# Altium project 电磁阀V4.0_Project.PrjPcb
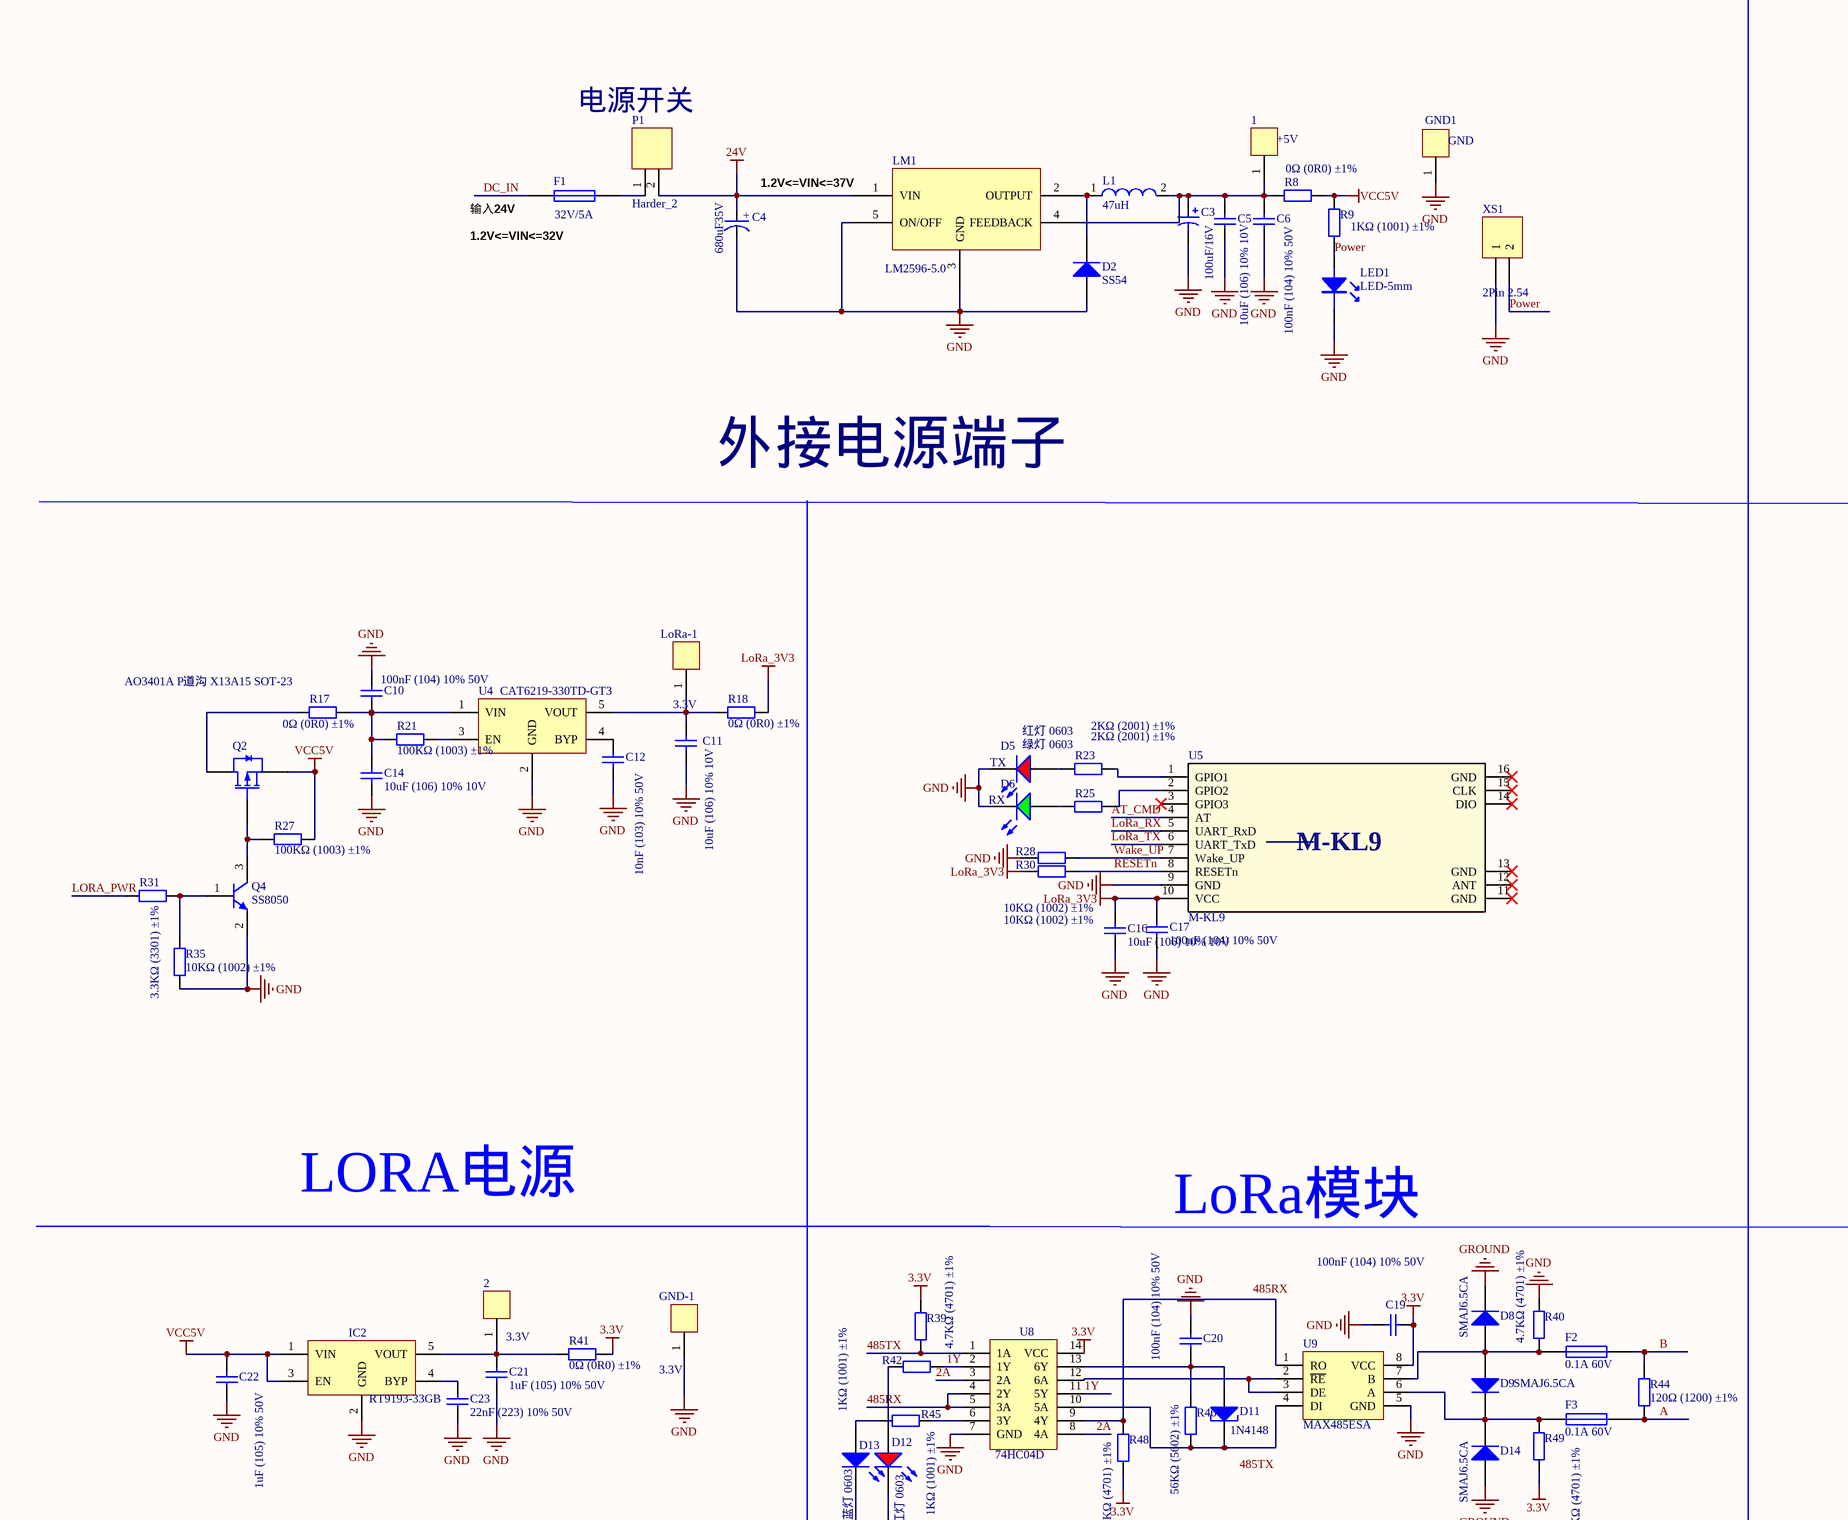
[diagram p0: 电磁阀V4.0.SchDoc, top left]
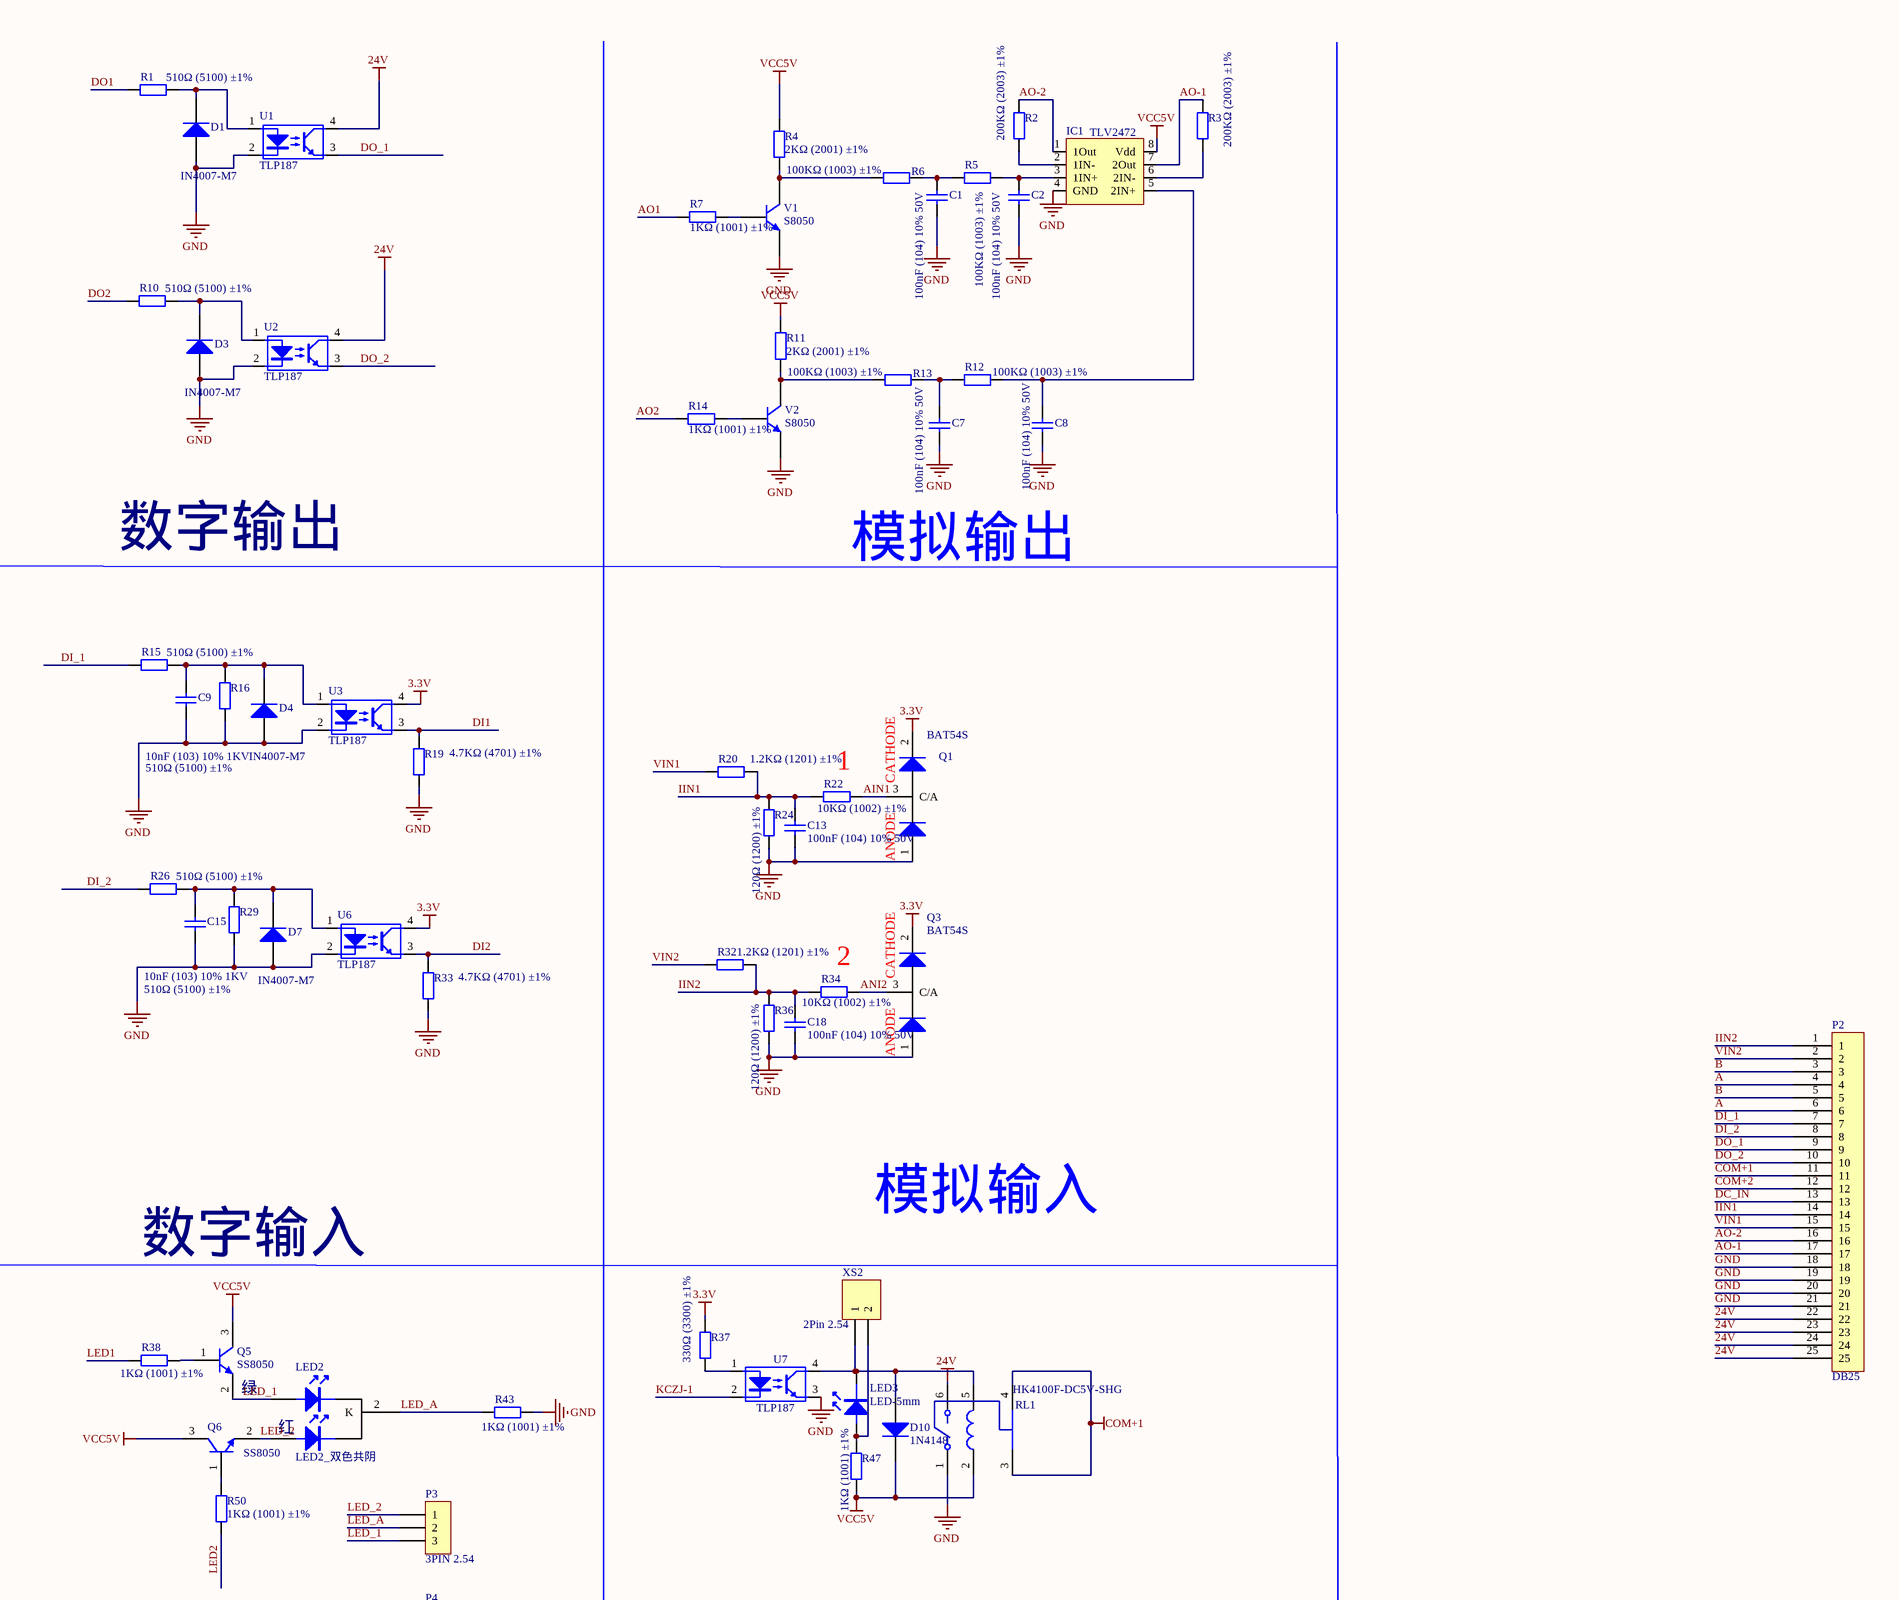
[diagram p1: 电磁阀V4.0.SchDoc, top right]
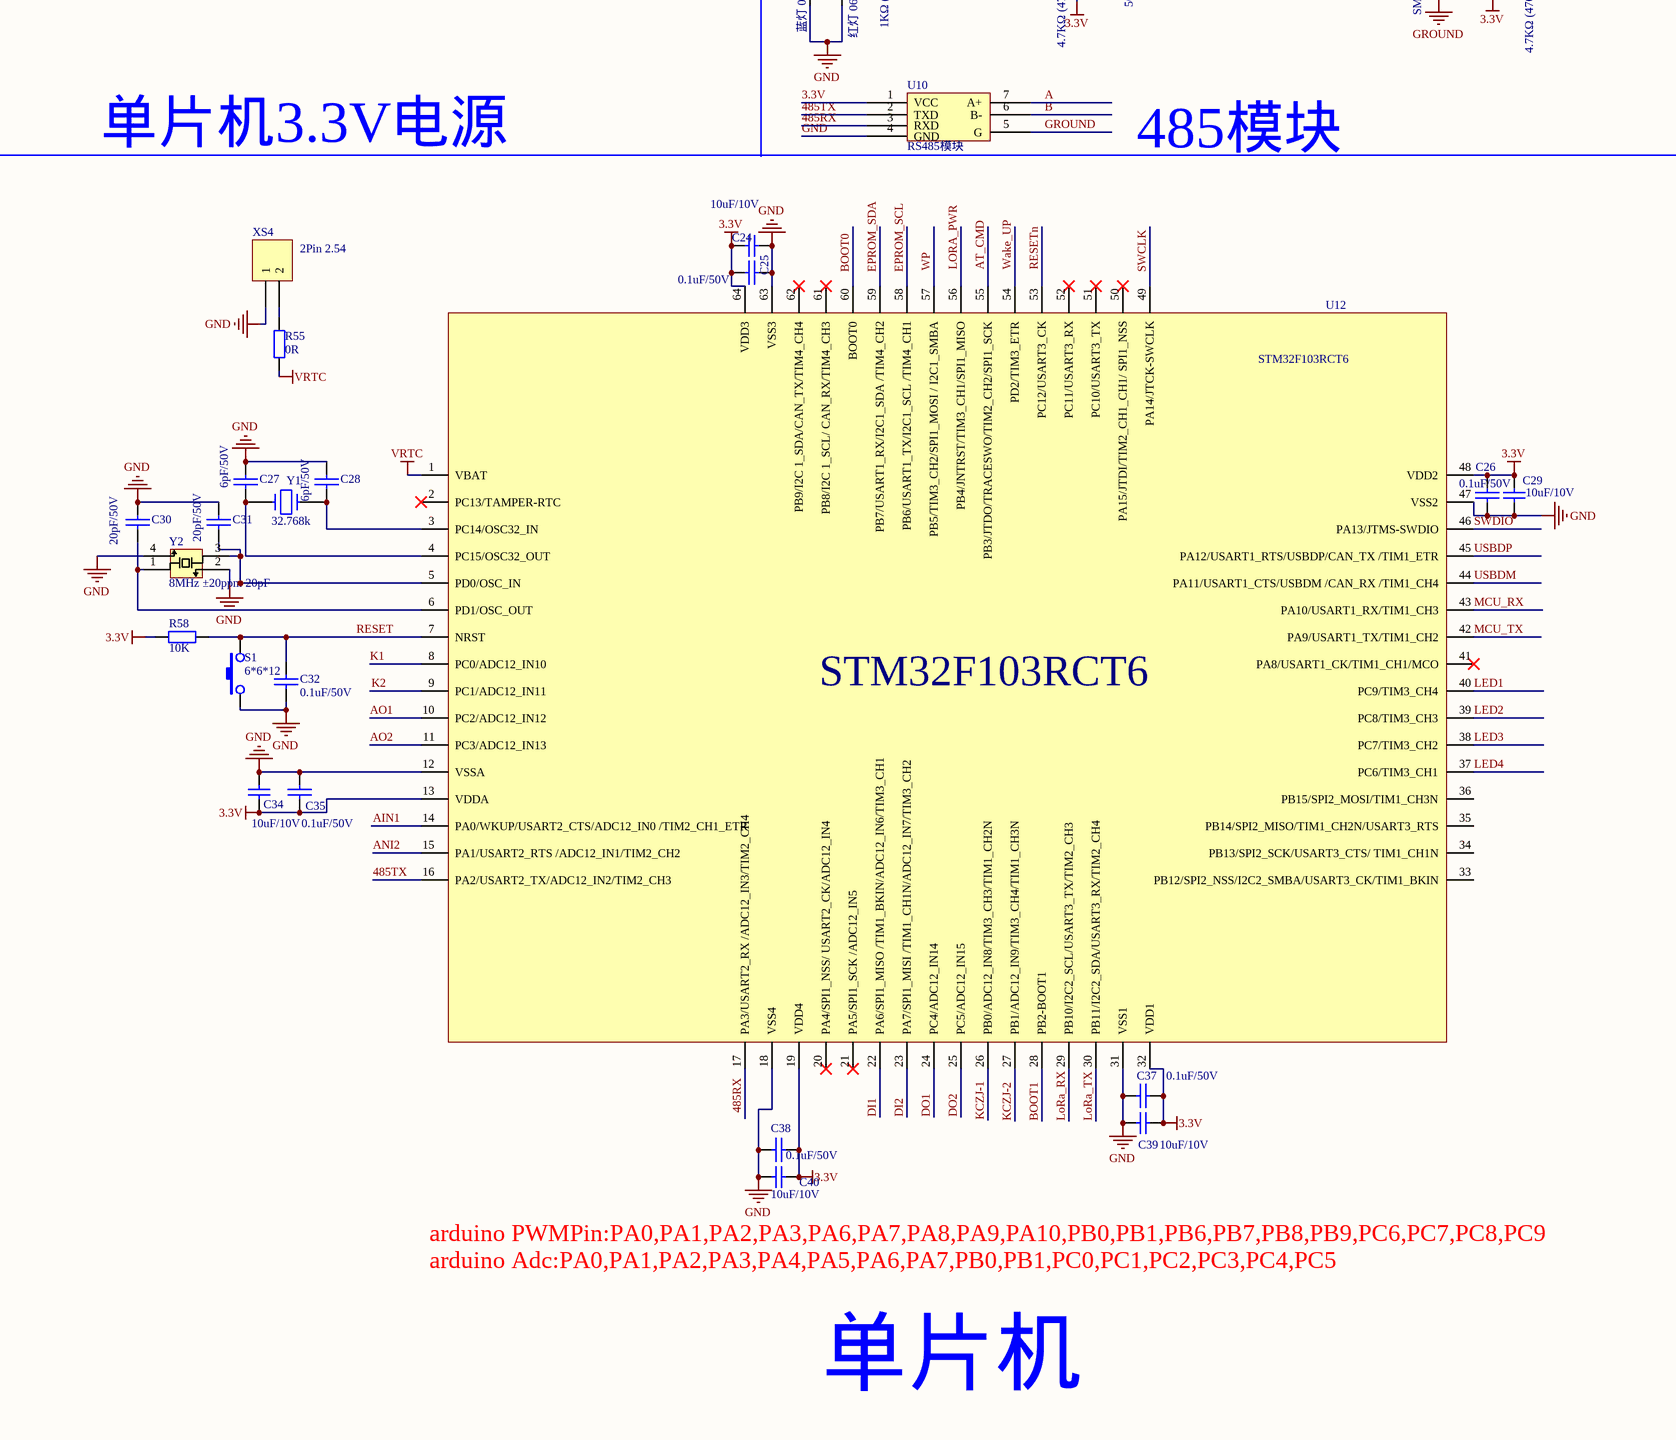
[diagram p2: 电磁阀V4.0.SchDoc, bottom left]
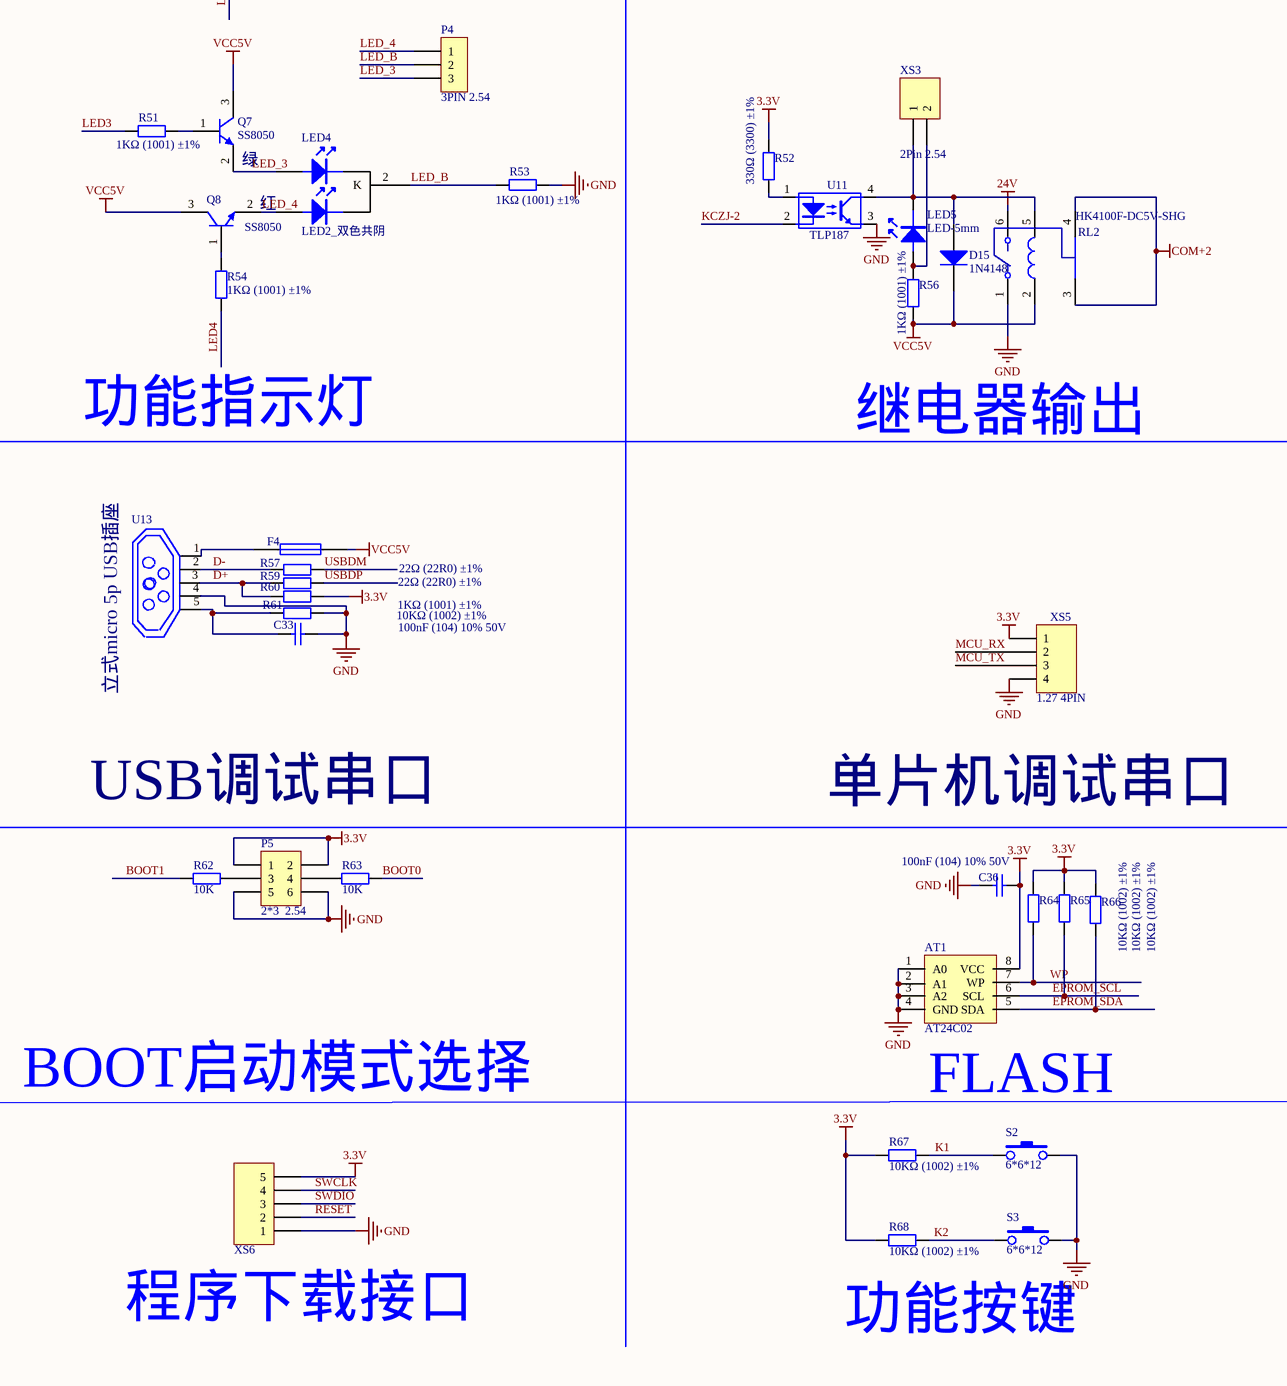
[diagram p3: 电磁阀V4.0.SchDoc, bottom right]
1 sheet, 183 parts. Net scope: global (net labels, ports and power ports of the same name join across sheets).
Board file: 电磁阀V4.0.PcbDoc

## Sheet 电磁阀V4.0.SchDoc
size A1

### Parts
1  +5V  [TEST_POINT]
2  3.3V  [TEST_POINT]
AT1  AT24C02  [AT24C02]
C1  100nF (104) 10% 50V  [LC-0603_C]
C2  100nF (104) 10% 50V  [LC-0603_C]
C3  100uF/16V  [CAP5*X]
C4  680uF35V  [C10x16]
C5  10uF (106) 10% 10V  [LC-0603_C]
C6  100nF (104) 10% 50V  [LC-0603_C]
C7  100nF (104) 10% 50V  [LC-0603_C]
C8  100nF (104) 10% 50V  [LC-0603_C]
C9  10nF (103) 10% 1KV  [LC-1206_C]
C10  100nF (104) 10% 50V  [LC-0603_C]
C11  10uF (106) 10% 10V  [LC-0603_C]
C12  10nF (103) 10% 50V  [LC-0603_C]
C13  100nF (104) 10% 50V  [LC-0603_C]
C14  10uF (106) 10% 10V  [LC-0603_C]
C15  10nF (103) 10% 1KV  [LC-1206_C]
C16  10uF (106) 10% 10V  [LC-0603_C]
C17  100nF (104) 10% 50V  [LC-0603_C]
C18  100nF (104) 10% 50V  [LC-0603_C]
C19  100nF (104) 10% 50V  [LC-0603_C]
C20  100nF (104) 10% 50V  [LC-0603_C]
C21  1uF (105) 10% 50V  [LC-0603_C]
C22  1uF (105) 10% 50V  [LC-0603_C]
C23  22nF (223) 10% 50V  [LC-0603_C]
C24  10uF/10V  [C-0603]
C25  0.1uF/50V  [C-0603]
C26  0.1uF/50V  [C-0603]
C27  6pF/50V  [C-0603]
C28  6pF/50V  [C-0603]
C29  10uF/10V  [C-0603]
C30  20pF/50V  [C-0603]
C31  20pF/50V  [C-0603]
C32  0.1uF/50V  [C-0603]
C33  100nF (104) 10% 50V  [LC-0603_C]
C34  10uF/10V  [C-0603]
C35  0.1uF/50V  [C-0603]
C36  100nF (104) 10% 50V  [LC-0603_C]
C37  0.1uF/50V  [C-0603]
C38  0.1uF/50V  [C-0603]
C39  10uF/10V  [C-0603]
C40  10uF/10V  [C-0603]
D1  IN4007-M7  [DO-214AC]
D2  SS54  [LC-SMA(DO-214AC)_S1]
D3  IN4007-M7  [DO-214AC]
D4  IN4007-M7  [DO-214AC]
D5  红灯 0603  [LC-0603_LED_S1]
D6  绿灯 0603  [LC-0603_LED_S1]
D7  IN4007-M7  [DO-214AC]
D8  SMAJ6.5CA  [DO-214AC]
D9  SMAJ6.5CA  [DO-214AC]
D10  1N4148  [SOD-123]
D11  1N4148  [LL-34]
D12  红灯 0603  [LC-0603_LED_S1]
D13  蓝灯 0603  [LC-0603_LED_S1]
D14  SMAJ6.5CA  [DO-214AC]
D15  1N4148  [SOD-123]
F1  32V/5A  [Fuse-1206]
F2  0.1A 60V  [R-1812]
F3  0.1A 60V  [R-1812]
F4  32V/5A  [FUSE-1206]  (value not drawn)
GND1  GND  [TEST_POINT]
GND-1  3.3V  [TEST_POINT]
IC1  TLV2472  [SOP8]
IC2  RT9193-33GB  [SOT23-5]
L1  value 47uH  [SMD,13.8x12.6x7mm]  (hidden comment: 47uH ±20%)
LED1  LED-5mm  [LED_5mm]
LED2  LED2_双色共阴  [双色LED]
LED3  LED-5mm  [LED_5mm]
LED4  LED2_双色共阴  [双色LED]
LED5  LED-5mm  [LED_5mm]
LM1  LM2596-5.0  [LC-TO-263-5]
LoRa-1  3.3V  [TEST_POINT]
P1  Harder_2  [2Pin-2.54A]
P2  DB25  [DB25]
P3  3PIN 2.54  [JXT-3-l]
P4  3PIN 2.54  [JXT-3-l]
P5  2*3  2.54  [201S2X3]
Q1  BAT54S  [SOT-23-3]
Q2  AO3401A P道沟 X13A15 SOT-23  [LC-SOT-23-3L]
Q3  BAT54S  [SOT-23-3]
Q4  SS8050  [SOT-23]
Q5  SS8050  [SOT-23]
Q6  SS8050  [SOT-23]
Q7  SS8050  [SOT-23]
Q8  SS8050  [SOT-23]
R1  510Ω (5100) ±1%  [LC-0603_R]
R2  200KΩ (2003) ±1%  [LC-0603_R]
R3  200KΩ (2003) ±1%  [LC-0603_R]
R4  2KΩ (2001) ±1%  [LC-0603_R]
R5  100KΩ (1003) ±1%  [LC-0603_R]
R6  100KΩ (1003) ±1%  [LC-0603_R]
R7  1KΩ (1001) ±1%  [LC-0603_R]
R8  0Ω (0R0) ±1%  [LC-0603_R]
R9  1KΩ (1001) ±1%  [LC-0603_R]
R10  510Ω (5100) ±1%  [LC-0603_R]
R11  2KΩ (2001) ±1%  [LC-0603_R]
R12  100KΩ (1003) ±1%  [LC-0603_R]
R13  100KΩ (1003) ±1%  [LC-0603_R]
R14  1KΩ (1001) ±1%  [LC-0603_R]
R15  510Ω (5100) ±1%  [LC-0603_R]
R16  510Ω (5100) ±1%  [LC-0603_R]
R17  0Ω (0R0) ±1%  [LC-0603_R]
R18  0Ω (0R0) ±1%  [LC-0603_R]
R19  4.7KΩ (4701) ±1%  [LC-0603_R]
R20  1.2KΩ (1201) ±1%  [LC-0603_R]
R21  100KΩ (1003) ±1%  [LC-0603_R]
R22  10KΩ (1002) ±1%  [LC-0603_R]
R23  2KΩ (2001) ±1%  [LC-0603_R]
R24  120Ω (1200) ±1%  [LC-0603_R]
R25  2KΩ (2001) ±1%  [LC-0603_R]
R26  510Ω (5100) ±1%  [LC-0603_R]
R27  100KΩ (1003) ±1%  [LC-0603_R]
R28  10KΩ (1002) ±1%  [LC-0603_R]
R29  510Ω (5100) ±1%  [LC-0603_R]
R30  10KΩ (1002) ±1%  [LC-0603_R]
R31  3.3KΩ (3301) ±1%  [LC-0603_R]
R32  1.2KΩ (1201) ±1%  [LC-0603_R]
R33  4.7KΩ (4701) ±1%  [LC-0603_R]
R34  10KΩ (1002) ±1%  [LC-0603_R]
R35  10KΩ (1002) ±1%  [LC-0603_R]
R36  120Ω (1200) ±1%  [LC-0603_R]
R37  330Ω (3300) ±1%  [LC-0603_R]
R38  1KΩ (1001) ±1%  [LC-0603_R]
R39  4.7KΩ (4701) ±1%  [LC-0603_R]
R40  4.7KΩ (4701) ±1%  [LC-0603_R]
R41  0Ω (0R0) ±1%  [LC-0603_R]
R42  1KΩ (1001) ±1%  [LC-0603_R]
R43  1KΩ (1001) ±1%  [LC-0603_R]
R44  120Ω (1200) ±1%  [LC-0603_R]
R45  1KΩ (1001) ±1%  [LC-0603_R]
R46  56KΩ (5602) ±1%  [LC-0603_R]
R47  1KΩ (1001) ±1%  [LC-0603_R]
R48  4.7KΩ (4701) ±1%  [LC-0603_R]
R49  4.7KΩ (4701) ±1%  [LC-0603_R]
R50  1KΩ (1001) ±1%  [LC-0603_R]
R51  1KΩ (1001) ±1%  [LC-0603_R]
R52  330Ω (3300) ±1%  [LC-0603_R]
R53  1KΩ (1001) ±1%  [LC-0603_R]
R54  1KΩ (1001) ±1%  [LC-0603_R]
R55  0R  [R-0603]
R56  1KΩ (1001) ±1%  [LC-0603_R]
R57  22Ω (22R0) ±1%  [LC-0603_R]
R58  10K  [R-0603]
R59  22Ω (22R0) ±1%  [LC-0603_R]
R60  1KΩ (1001) ±1%  [LC-0603_R]
R61  10KΩ (1002) ±1%  [LC-0603_R]
R62  10K  [R-0603]
R63  10K  [R-0603]
R64  10KΩ (1002) ±1%  [LC-0603_R]
R65  10KΩ (1002) ±1%  [LC-0603_R]
R66  10KΩ (1002) ±1%  [LC-0603_R]
R67  10KΩ (1002) ±1%  [LC-0603_R]
R68  10KΩ (1002) ±1%  [LC-0603_R]
RL1  HK4100F-DC5V-SHG  [HK4100F-DC5V-SHG]
RL2  HK4100F-DC5V-SHG  [HK4100F-DC5V-SHG]
S1  6*6*12  [KEY-7.0*7.0]
S2  6*6*12  [KEY-7.0*7.0]
S3  6*6*12  [KEY-7.0*7.0]
U1  TLP187  [LC-SOP-4_P2.54]
U2  TLP187  [LC-SOP-4_P2.54]
U3  TLP187  [LC-SOP-4_P2.54]
U4  CAT6219-330TD-GT3  [SOT23-5]
U5  M-KL9  [M-KL9]
U6  TLP187  [LC-SOP-4_P2.54]
U7  TLP187  [TLP187 - duplicate]
U8  74HC04D  [SOIC-14_150mil]
U9  MAX485ESA  [SOP-8_150mil]
U10  RS485模块  [RS485MOD]
U11  TLP187  [TLP187 - duplicate]
U12  STM32F103RCT6  [LQFP-64_10x10x05P]
U13  立式micro 5p USB插座  [USB插座 micro 5p]
V1  S8050  [SOT-23-3]
V2  S8050  [SOT-23-3]
XS1  2Pin 2.54  [JXT-2]
XS2  2Pin 2.54  [JXT-2]
XS3  2Pin 2.54  [JXT-2]
XS4  2Pin 2.54  [JXT-2]
XS5  1.27 4PIN  [JXT-4]
XS6  Header 2.54X4  [JXT-5]  (value not drawn)
Y1  32.768k  [3215_32.768K]
Y2  8MHz ±20ppm 20pF  [LC-SMD-5032_4P]

### Nets
3.3V: AT1.8(VCC) C19.1 C24.1 C25.1 C26.1 C29.2 C34.2 C35.2 C36.2 C37.2 C38.2 C39.1 C40.1 P5.1 P5.2 Q1.2(CATHODE) Q3.2(CATHODE) R37.2 R39.2 R41.2 R48.1 R49.1 R52.2 R58.2 R60.2 R64.2 R65.2 R66.2 R67.1 R68.1 U3.4(Collector) U6.4(Collector) U8.14(VCC) U9.8(VCC) U10.1(VCC) U12.13(VDDA) U12.19(VDD4) U12.32(VDD1) U12.48(VDD2) U12.64(VDD3) XS5.1 XS6.5
24V: C4.1 LM1.1(VIN) P1.2 P2.22 P2.23 P2.24 P2.25 RL1.6 RL2.6 U1.4(Collector) U2.4(Collector)
COM+1: P2.11 RL1.3 RL1.4
COM+2: P2.12 RL2.3 RL2.4
GND: AT1.1(A0) AT1.2(A1) AT1.3(A2) AT1.4(GND) C1.1 C2.1 C3.2 C4.2 C5.1 C6.1 C7.1 C8.1 C9.1 C10.2 C11.1 C12.1 C13.1 C14.1 C15.1 C16.1 C17.1 C18.1 C19.2 C20.2 C21.1 C22.1 C23.1 C24.2 C25.2 C26.2 C27.2 C28.2 C29.1 C30.2 C31.2 C32.2 C33.1 C34.1 C35.1 C36.1 C37.1 C38.1 C39.2 C40.2 D1.1(A) D2.1(A) D3.1(A) D4.1(A) D5.K D6.K D7.1(A) D12.K D13.K GND1.1 GND-1.1 IC1.4(GND) IC2.2(GND) LED1.2 LM1.3(GND) LM1.5(ON/OFF) P2.18 P2.19 P2.20 P2.21 P5.5 P5.6 Q1.1(ANODE) Q3.1(ANODE) Q4.2(E) R16.1 R19.1 R24.1 R28.1 R29.1 R33.1 R35.1 R36.1 R40.1 R43.1 R53.1 R61.1 RL1.1 RL2.1 S1.1 S2.2 S3.2 U1.2(LED_Cathode) U2.2(LED_Cathode) U3.2(LED_Cathode) U4.2(GND) U5.9(GND) U6.2(LED_Cathode) U7.3(Emitter) U8.7(GND) U9.5(GND) U10.4(GND) U11.3(Emitter) U12.12(VSSA) U12.18(VSS4) U12.31(VSS1) U12.47(VSS2) U12.63(VSS3) U13.4 V1.2(E) V2.2(E) XS1.1 XS4.1 XS5.4 XS6.1 Y2.2(G) Y2.4(G)
GROUND: D8.2(K) D14.1(A) U10.5(G)
LoRa_3V3: C16.2 C17.2 R18.2 R30.1 U5.10(VCC)
VCC5V: C22.2 D10.2(K) D15.2(K) F4.2 IC1.8(Vdd) IC2.1(VIN) IC2.3(EN) Q2.2(S) Q5.3(C) Q6.3(C) Q7.3(C) Q8.3(C) R4.2 R8.2 R9.1 R11.2 R27.2 R47.1 R56.1 RL1.2 RL2.2
VRTC: R55.2 U12.1(VBAT)
1Y: R42.2 U8.2(1Y) U8.11(5Y)
2A: U8.3(2A) U8.8(4A)
485RX: U8.4(2Y) U8.5(3A) U10.3(RXD) U12.17(PA3/USART2_RX_/ADC12_IN3/TIM2_CH4)
485TX: R39.1 U8.1(1A) U10.2(TXD) U12.16(PA2/USART2_TX/ADC12_IN2/TIM2_CH3)
A: F3.2 P2.4 P2.6 R44.1 U10.7(A+)
AIN1: Q1.3(C/A) R22.2 U12.14(PA0/WKUP/USART2_CTS/ADC12_IN0_/TIM2_CH1_ETR)
ANI2: Q3.3(C/A) R34.2 U12.15(PA1/USART2_RTS_/ADC12_IN1/TIM2_CH2)
AO1: R7.1 U12.10(PC2/ADC12_IN12)
AO2: R14.1 U12.11(PC3/ADC12_IN13)
AO-1: IC1.7(2Out) P2.17 R3.2
AO-2: IC1.1(1Out) P2.16 R2.2
AT_CMD: U5.4(AT) U12.55(PB3/JTDO/TRACESWO/TIM2_CH2/SPI1_SCK)
B: F2.2 P2.3 P2.5 R44.2 U10.6(B-)
BOOT0: R63.2 U12.60(BOOT0)
BOOT1: R62.1 U12.28(PB2-BOOT1)
D+: R59.1 R60.1 U13.3
D-: R57.1 U13.2
DC_IN: F1.1 P2.13
DI1: R19.2 U3.3(Emitter) U12.22(PA6/SPI1_MISO_/TIM1_BKIN/ADC12_IN6/TIM3_CH1)
DI2: R33.2 U6.3(Emitter) U12.23(PA7/SPI1_MISI_/TIM1_CH1N/ADC12_IN7/TIM3_CH2)
DI_1: P2.7 R15.1
DI_2: P2.8 R26.1
DO1: R1.1 U12.24(PC4/ADC12_IN14)
DO2: R10.1 U12.25(PC5/ADC12_IN15)
DO_1: P2.9 U1.3(Emitter)
DO_2: P2.10 U2.3(Emitter)
EPROM_SCL: AT1.6(SCL) R65.1 U12.58(PB6/USART1_TX/I2C1_SCL_/TIM4_CH1)
EPROM_SDA: AT1.5(SDA) R66.1 U12.59(PB7/USART1_RX/I2C1_SDA_/TIM4_CH2)
IIN1: C13.2 P2.14 R20.2 R22.1 R24.2
IIN2: C18.2 P2.1 R32.2 R34.1 R36.2
K1: R67.2 S2.1 U12.8(PC0/ADC12_IN10)
K2: R68.2 S3.1 U12.9(PC1/ADC12_IN11)
KCZJ-1: U7.2(LED_Cathode) U12.26(PB0/ADC12_IN8/TIM3_CH3/TIM1_CH2N)
KCZJ-2: U11.2(LED_Cathode) U12.27(PB1/ADC12_IN9/TIM3_CH4/TIM1_CH3N)
LED1: R38.1 U12.40(PC9/TIM3_CH4)
LED2: R50.2 U12.39(PC8/TIM3_CH3)
LED3: R51.1 U12.38(PC7/TIM3_CH2)
LED4: R54.2 U12.37(PC6/TIM3_CH1)
LED_1: LED2.1(A) P3.3 Q5.2(E)
LED_2: LED2.3(A) P3.1 Q6.2(E)
LED_3: LED4.1(A) P4.3 Q7.2(E)
LED_4: LED4.3(A) P4.1 Q8.2(E)
LED_A: LED2.2(K) P3.2 R43.2
LED_B: LED4.2(K) P4.2 R53.2
LORA_PWR: R31.1 U12.56(PB4/JNTRST/TIM3_CH1/SPI1_MISO)
LoRa_RX: U5.5(UART_RxD) U12.29(PB10/I2C2_SCL/USART3_TX/TIM2_CH3)
LoRa_TX: U5.6(UART_TxD) U12.30(PB11/I2C2_SDA/USART3_RX/TIM2_CH4)
MCU_RX: U12.43(PA10/USART1_RX/TIM1_CH3) XS5.2
MCU_TX: U12.42(PA9/USART1_TX/TIM1_CH2) XS5.3
Power: LED1.1 R9.2 XS1.2
RESET: C32.1 R58.1 S1.2 U12.7(NRST) XS6.2
RESETn: R30.2 U5.8(RESETn) U12.53(PC12/USART3_CK)
SWCLK: U12.49(PA14/JTCK-SWCLK) XS6.4
SWDIO: U12.46(PA13/JTMS-SWDIO) XS6.3
USBDM: R57.2 U12.44(PA11/USART1_CTS/USBDM_/CAN_RX_/TIM1_CH4)
USBDP: R59.2 U12.45(PA12/USART1_RTS/USBDP/CAN_TX_/TIM1_ETR)
VIN1: P2.15 R20.1
VIN2: P2.2 R32.1
Wake_UP: R28.2 U5.7(Wake_UP) U12.54(PD2/TIM3_ETR)
WP: AT1.7(WP) R64.1 U12.57(PB5/TIM3_CH2/SPI1_MOSI_/_I2C1_SMBA)
Net1_1: 1.1 C3.1 C5.2 C6.2 L1.2 LM1.4(FEEDBACK) R8.1
Net2_1: 2.1 C21.2 IC2.5(VOUT) R41.1
NetC1_2: C1.2 R5.1 R6.2
NetC2_2: C2.2 IC1.3(1IN+) R5.2
NetC7_2: C7.2 R12.1 R13.2
NetC8_2: C8.2 IC1.5(2IN+) R12.2
NetC9_2: C9.2 D4.2(K) R15.2 R16.2 U3.1(LED_Anode)
NetC10_1: C10.1 C14.2 R17.2 R21.1 U4.1(VIN)
NetC11_2: C11.2 LoRa-1.1 R18.1 U4.5(VOUT)
NetC12_2: C12.2 U4.4(BYP)
NetC15_2: C15.2 D7.2(K) R26.2 R29.2 U6.1(LED_Anode)
NetC20_1: C20.1 D11.1 R46.2 U8.13(6Y)
NetC23_2: C23.2 IC2.4(BYP)
NetC27_1: C27.1 U12.4(PC15/OSC32_OUT) Y1.1
NetC28_1: C28.1 U12.3(PC14/OSC32_IN) Y1.2
NetC30_1: C30.1 U12.6(PD1/OSC_OUT) Y2.1(T1)
NetC31_1: C31.1 U12.5(PD0/OSC_IN) Y2.3(T2)
NetC33_2: C33.2 R61.2 U13.5
NetD1_2: D1.2(K) R1.2 U1.1(LED_Anode)
NetD2_2: D2.2(K) L1.1 LM1.2(OUTPUT)
NetD3_2: D3.2(K) R10.2 U2.1(LED_Anode)
NetD5_A: D5.A R23.1
NetD6_A: D6.A R25.1
NetD8_1: D8.1(A) D9.1(A) F2.1 R40.2 U9.7(B)
NetD9_2: D9.2(K) D14.2(K) F3.1 R49.2 U9.6(A)
NetD10_1: D10.1(A) LED3.2 RL1.5 U7.4(Collector) XS2.1
NetD11_2: D11.2 R46.1 U8.10(5A) U9.4(DI)
NetD12_A: D12.A R42.1
NetD13_A: D13.A R45.1
NetD15_1: D15.1(A) LED5.2 RL2.5 U11.4(Collector) XS3.1
NetF1_2: F1.2 P1.1
NetF4_1: F4.1 U13.1
NetIC1_2: IC1.2(1IN-) R2.1
NetIC1_6: IC1.6(2IN-) R3.1
NetLED3_1: LED3.1 R47.2 XS2.2
NetLED5_1: LED5.1 R56.2 XS3.2
NetP5_3: P5.3 R62.2
NetP5_4: P5.4 R63.1
NetQ2_1: Q2.1(G) Q4.3(C) R27.1
NetQ2_3: Q2.3(D) R17.1
NetQ4_1: Q4.1(B) R31.2 R35.2
NetQ5_1: Q5.1(B) R38.2
NetQ6_1: Q6.1(B) R50.1
NetQ7_1: Q7.1(B) R51.2
NetQ8_1: Q8.1(B) R54.1
NetR4_1: R4.1 R6.1 V1.3(C)
NetR7_2: R7.2 V1.1(B)
NetR11_1: R11.1 R13.1 V2.3(C)
NetR14_2: R14.2 V2.1(B)
NetR21_2: R21.2 U4.3(EN)
NetR23_2: R23.2 U5.1(GPIO1)
NetR25_2: R25.2 U5.2(GPIO2)
NetR37_1: R37.1 U7.1(LED_Anode)
NetR45_2: R45.2 U8.6(3Y)
NetR48_2: R48.2 U8.9(4Y) U9.1(RO)
NetR52_1: R52.1 U11.1(LED_Anode)
NetR55_1: R55.1 XS4.2
NetU8_12: U8.12(6A) U9.2(~{RE}) U9.3(DE)

Not connected (* = marked no-connect by the designer): U5 3(GPIO3)* 11(GND)* 12(ANT)* 13(GND)* 14(DIO)* 15(CLK)* 16(GND)*; U12 2(PC13/TAMPER-RTC)* 20(PA4/SPI1_NSS/_USART2_CK/ADC12_IN4)* 21(PA5/SPI1_SCK_/ADC12_IN5)* 33(PB12/SPI2_NSS/I2C2_SMBA/USART3_CK/TIM1_BKIN) 34(PB13/SPI2_SCK/USART3_CTS/_TIM1_CH1N) 35(PB14/SPI2_MISO/TIM1_CH2N/USART3_RTS) 36(PB15/SPI2_MOSI/TIM1_CH3N) 41(PA8/USART1_CK/TIM1_CH1/MCO)* 50(PA15/JTDI/TIM2_CH1_CH1/_SPI1_NSS)* 51(PC10/USART3_TX)* 52(PC11/USART3_RX)* 61(PB8/I2C_1_SCL/_CAN_RX/TIM4_CH3)* 62(PB9/I2C_1_SDA/CAN_TX/TIM4_CH4)*

### Notes on the sheet
- 电源开关
- 1.2V<=VIN<=37V
- (near F1) 1.2V<=VIN<=32V
- 输入24V
- 外接电源端子
- 数字输出
- 模拟输出
- (near R22) 1
- (near D5) TX
- (near D6) RX
- (near R34) 2
- LORA电源
- 模拟输入
- LoRa模块
- 数字输入
- (near Q5) 绿
- (near LED2) 红
- 单片机3.3V电源
- 485模块
- (near Q7) 绿
- 红
- 功能指示灯
- 继电器输出
- USB调试串口
- 单片机调试串口
- BOOT启动模式选择
- FLASH
- (near C40) arduino PWMPin:PA0,PA1,PA2,PA3,PA6,PA7,PA8,PA9,PA10,PB0,PB1,PB6,PB7,PB8,PB9,PC6,PC7,PC8,PC9
- arduino Adc:PA0,PA1,PA2,PA3,PA4,PA5,PA6,PA7,PB0,PB1,PC0,PC1,PC2,PC3,PC4,PC5
- 单片机
- (near XS6) 程序下载接口
- (near R68) 功能按键
- Labels drawn without touching a wire or pin: 485RX, 485TX
- (in symbol CAP_DIP) +

### Library data of the parts
1 2 GND1 GND-1 LoRa-1 = TEST_POINT: 测试点
C1 C2 C6-C8 C10 C13 C17-C20 C33 C36 = 0603 100nF (104) 10% 50V: 贴片电容; ComponentLink1Description: 供应商链接; ComponentLink1URL: http://www.szlcsc.com/product/details_15331.html; Package: 0603; Supplier: LC; SuppliersPartNumber: C14663
C3 = Ca: 直插电解电容; Published: 8-Jun-2000; LatestRevisionDate: 17-Jul-2002; LatestRevisionNote: Re-released for DXP Platform.; PackageReference: RB7.6-15; Publisher: Altium Limited; Value: 100uF/16V
C4 = CAP_DIP
C5 C11 C14 C16 = 0603 10uF (106) 10% 10V: 贴片电容; ComponentLink1Description: 供应商链接; ComponentLink1URL: http://www.szlcsc.com/product/details_20411.html; Package: 0603; Supplier: LC; SuppliersPartNumber: C19702
C9 C15 = 1206 10nF (103) 10% 50V: 贴片电容; ComponentLink1Description: 供应商链接; ComponentLink1URL: http://www.szlcsc.com/product/details_2198.html; Package: 1206; Supplier: LC; SuppliersPartNumber: C1846
C12 = 0603 10nF (103) 10% 50V: 贴片电容; ComponentLink1Description: 供应商链接; ComponentLink1URL: http://www.szlcsc.com/product/details_58143.html; Package: 0603; Supplier: LC; SuppliersPartNumber: C57112
C21 C22 = 0603 1uF (105) 10% 50V: 贴片电容; ComponentLink1Description: 供应商链接; ComponentLink1URL: http://www.szlcsc.com/product/details_16531.html; Package: 0603; Supplier: LC; SuppliersPartNumber: C15849
C23 = 0603 22nF (223) 10% 50V: 贴片电容; ComponentLink1Description: 供应商链接; ComponentLink1URL: http://www.szlcsc.com/product/details_21834.html; Package: 0603; Supplier: LC; SuppliersPartNumber: C21122
C24 C29 C34 C39 C40 = Cap: 贴片电容; Published: 8-Jun-2000; LatestRevisionDate: 17-Jul-2002; LatestRevisionNote: Re-released for DXP Platform.; PackageReference: RAD-0.3; Publisher: Altium Limited; Value: 10uF/10V
C25-C28 C30-C32 C35 C37 C38 = CAP: 贴片电容
D1 D3 D4 D7 = Diode 1N4001: 二极管; Published: 8-Jun-2000; LatestRevisionDate: 17-Jul-2002; LatestRevisionNote: Re-released for DXP Platform.; DatasheetVersion: 1998; PackageVersion: Aug-1999; PackageReference: DO-41; Publisher: Altium Limited; PackageDescription: Diode, Axial; Body 5.2 x 2.7 mm (LxDia. max), Lead Dia. 0.86 mm (max); Code_JEDEC: DO-204-AL; ComponentLink1Description: Manufacturer Link; ComponentLink1URL: http://www.fairchildsemi.com/; ComponentLink2Description: Datasheet; ComponentLink2URL: http://www.fairchildsemi.com/ds/1N%2F1N4001.pdf
D2 = SMA(DO-214AC) SS54: 二极管; ComponentLink1Description: 供应商链接; ComponentLink1URL: http://www.szlcsc.com/product/details_23178.html; Package: SMA(DO-214AC); Supplier: LC; SuppliersPartNumber: C22452
D5 D12 = 0603 红灯: 发光二极管; ComponentLink1Description: 供应商链接; ComponentLink1URL: http://www.szlcsc.com/product/details_2659.html; Package: 0603; Supplier: LC; SuppliersPartNumber: C2286
D6 = 0603 绿灯: 发光二极管; ComponentLink1Description: 供应商链接; ComponentLink1URL: http://www.szlcsc.com/product/details_73152.html; Package: 0603; Supplier: LC; SuppliersPartNumber: C72043
D8 D9 D14 = Diode: 通用二极管; Published: 8-Jun-2000; LatestRevisionDate: 17-Jul-2002; LatestRevisionNote: Re-released for DXP Platform.; PackageDocument: Sep-1996; PackageReference: SMC; Publisher: Altium Limited; Code_JEDEC: DO-214-AB
D10 D15 = 开关二极管: ComponentLink1Description: 供应商链接; ComponentLink1URL: http://www.szlcsc.com/product/details_10338.html; Package: LL-34; Supplier: LC; SuppliersPartNumber: C9808
D11 = Diode Zener: 稳压二极管; Published: 8-Jun-2000; LatestRevisionDate: 17-Jul-2002; LatestRevisionNote: Re-released for DXP Platform.; PackageReference: DIODE-0.7; Publisher: Altium Limited; PackageDescription: Diode, Thru-Hole; 2 Leads; 0.7 in Pin Spacing
D13 = 0603 蓝灯: 发光二极管; ComponentLink1Description: 供应商链接; ComponentLink1URL: http://www.szlcsc.com/product/details_73150.html; Package: 0603; Supplier: LC; SuppliersPartNumber: C72041
F1 F4 = Fuse: 贴片保险丝; Published: 8-Jun-2000; LatestRevisionDate: 17-Jul-2002; LatestRevisionNote: Re-released for DXP Platform.; PackageReference: PIN-W2/E2.8; Publisher: Altium Limited
F2 F3 = Fuse_1: 贴片保险丝 0.1A 60V; Published: 8-Jun-2000; LatestRevisionDate: 17-Jul-2002; LatestRevisionNote: Re-released for DXP Platform.; PackageReference: PIN-W2/E2.8; Publisher: Altium Limited
IC1 = TLV2472: 输出放大
IC2 = CAT6219: 低压差线性稳压(LDO)
L1 = 47uH ±20%: 4R7功率电感; Code_IEC: 1005; Published: 8-Jun-2000; LatestRevisionDate: 29-May-2009; LatestRevisionNote: IPC-7351 Footprint Added.; PackageReference: 0402-A; Publisher: Altium Limited; PackageDescription: Chip Inductor; Code_JEITA: 0402
LED1 LED3 LED5 = LED-5mm: 发光二极管
LM1 = LM2596
P2 = DB25: DR25弯针
P3 P4 = Header 3H: 单排插针; LatestRevisionDate: 17-Jul-2002; LatestRevisionNote: Re-released for DXP Platform.; Publisher: Altium Limited
P5 = Header 2*3: 双排插针; LatestRevisionDate: 17-Jul-2002; LatestRevisionNote: Re-released for DXP Platform.; Publisher: Altium Limited
Q1 Q3 = BAT54S: 肖特基二极管
Q2 = AO3401A P道沟 X13A15 SOT-23: MOS(场效应管); ComponentLink1Description: 供应商链接; ComponentLink1URL: http://www.szlcsc.com/product/details_15801.html; Package: SOT-23; Supplier: LC; SuppliersPartNumber: C15127
Q4-Q8 = SS8050: NPN贴片三极管; Published: 8-Jun-2000; LatestRevisionDate: 15-Jan-2003; LatestRevisionNote: PCB Footprint 'BCY-W3/D4.7' replaced; DatasheetDocument: 1997; PackageDocument: Sep-1998; PackageReference: TO-92A; Publisher: Altium Limited; Code_JEDEC: TO-92A; ComponentLink1Description: Manufacturer Link; ComponentLink1URL: http://www.fairchildsemi.com/; ComponentLink2Description: Datasheet; ComponentLink2URL: http://www.fairchildsemi.com/ds/2N%2F2N3904.pdf
R1 R10 R15 R16 R26 R29 = 0603 510Ω (5100) 1%: 贴片电阻; ComponentLink1Description: 供应商链接; ComponentLink1URL: http://www.szlcsc.com/product/details_23920.html; Package: 0603; Supplier: LC; SuppliersPartNumber: C23193
R2 R3 = 0603 200KΩ (2003) 1%: 贴片电阻; ComponentLink1Description: 供应商链接; ComponentLink1URL: http://www.szlcsc.com/product/details_26554.html; Package: 0603; Supplier: LC; SuppliersPartNumber: C25811
R4 R11 R23 R25 = 0603 2KΩ (2001) 1%: 贴片电阻; ComponentLink1Description: 供应商链接; ComponentLink1URL: http://www.szlcsc.com/product/details_23702.html; Package: 0603; Supplier: LC; SuppliersPartNumber: C22975
R5 R6 R12 R13 R21 R27 = 0603 100KΩ (1003) 1%: 贴片电阻; ComponentLink1Description: 供应商链接; ComponentLink1URL: http://www.szlcsc.com/product/details_26546.html; Package: 0603; Supplier: LC; SuppliersPartNumber: C25803
R7 R9 R14 R38 R42 R43 R45 R47 R50 R51 R53 R54 R56 R60 = 0603 1KΩ (1001) 1%: 贴片电阻; ComponentLink1Description: 供应商链接; ComponentLink1URL: http://www.szlcsc.com/product/details_21904.html; Package: 0603; Supplier: LC; SuppliersPartNumber: C21190
R8 R17 R18 R41 = 0603 0Ω (0R0) 1%: 贴片电阻; ComponentLink1Description: 供应商链接; ComponentLink1URL: http://www.szlcsc.com/product/details_21903.html; Package: 0603; Supplier: LC; SuppliersPartNumber: C21189
R19 R33 R39 R40 R48 R49 = 0603 4.7KΩ (4701) 1%: 贴片电阻; ComponentLink1Description: 供应商链接; ComponentLink1URL: http://www.szlcsc.com/product/details_23889.html; Package: 0603; Supplier: LC; SuppliersPartNumber: C23162
R20 R32 = 0603 1.2KΩ (1201) 1%: 贴片电阻; ComponentLink1Description: 供应商链接; ComponentLink1URL: http://www.szlcsc.com/product/details_23492.html; Package: 0603; Supplier: LC; SuppliersPartNumber: C22765
R22 R28 R30 R34 R35 R61 R64-R68 = 0603 10KΩ (1002) 1%: 贴片电阻; ComponentLink1Description: 供应商链接; ComponentLink1URL: http://www.szlcsc.com/product/details_26547.html; Package: 0603; Supplier: LC; SuppliersPartNumber: C25804
R24 R36 R44 = 0603 120Ω (1200) 1%: 贴片电阻; ComponentLink1Description: 供应商链接; ComponentLink1URL: http://www.szlcsc.com/product/details_23514.html; Package: 0603; Supplier: LC; SuppliersPartNumber: C22787
R31 = 0603 3.3KΩ (3301) 1%: 贴片电阻; ComponentLink1Description: 供应商链接; ComponentLink1URL: http://www.szlcsc.com/product/details_23705.html; Package: 0603; Supplier: LC; SuppliersPartNumber: C22978
R37 R52 = 0603 330Ω (3300) 1%: 贴片电阻; ComponentLink1Description: 供应商链接; ComponentLink1URL: http://www.szlcsc.com/product/details_23865.html; Package: 0603; Supplier: LC; SuppliersPartNumber: C23138
R46 = 0603 56KΩ (5602) 1%: 贴片电阻; ComponentLink1Description: 供应商链接; ComponentLink1URL: http://www.szlcsc.com/product/details_23933.html; Package: 0603; Supplier: LC; SuppliersPartNumber: C23206
R55 R58 R62 R63 = Res2: 贴片电阻; Published: 8-Jun-2000; LatestRevisionDate: 17-Jul-2002; LatestRevisionNote: Re-released for DXP Platform.; PackageReference: AXIAL-0.4; Publisher: Altium Limited; PackageDescription: Axial Device, Thru-Hole; 2 Leads; 0.4 in Pin Spacing
  R55: Value: 0R
  R58 R62 R63: Value: 10K
R57 R59 = 0603 22Ω (22R0) 1%: 贴片电阻; ComponentLink1Description: 供应商链接; ComponentLink1URL: http://www.szlcsc.com/product/details_24078.html; Package: 0603; Supplier: LC; SuppliersPartNumber: C23345
RL1 RL2 = HK4100F-DC5V-SHG: 继电器; LatestRevisionDate: 17-Jul-2002; LatestRevisionNote: Re-released for DXP Platform.; Publisher: Altium Limited
S1-S3 = SW-PB_4: 侧脚带支架 微型按键; ComponentLink1Description: 侧脚带支架 微型按键; ComponentLink1URL: https://item.szlcsc.com/42081.html
U1-U3 U6 = TLP187: 光藕; ComponentLink1Description: https://item.szlcsc.com/51189.html; ComponentLink1URL: https://item.szlcsc.com/51189.html
U4 = CAT6219
U7 U11 = Q817: 光藕
U8 = 74HC14: 6路施密特触发反相器; LatestRevisionDate: 17-Jul-2002; LatestRevisionNote: Re-released for DXP Platform.; Publisher: Altium Limited
U9 = MAX485ESA: RS485收发芯片
U12 = STM32F103RCT6: 单片机
U13 = USB_micro_5p
V1 V2 = NPN: NPN三极管; Published: 8-Jun-2000; LatestRevisionDate: 17-Jul-2002; LatestRevisionNote: Re-released for DXP Platform.; PackageReference: TO-226-AA; Publisher: Altium Limited; PackageDescription: TO, Flat Index; 3 In-Line, Axial Leads; Body Dia. 4.8mm; Leads 0.55 x 0.51 mm (max); Code_JEDEC: TO-226-AA
XS1-XS4 = Header 2H: 单排插针; LatestRevisionDate: 17-Jul-2002; LatestRevisionNote: Re-released for DXP Platform.; Publisher: Altium Limited
XS5 = Hea: 1.27卧式贴片针座; LatestRevisionDate: 17-Jul-2002; LatestRevisionNote: Re-released for DXP Platform.; Publisher: Altium Limited
XS6 = Header 5: 1.27卧式贴片针座; LatestRevisionDate: 17-Jul-2002; LatestRevisionNote: Re-released for DXP Platform.; Publisher: Altium Limited
Y1 = CRYSTAL
Y2 = SMD-5032_4P 8MHz 20ppm 20pF: 贴片晶振; ComponentLink1Description: 供应商链接; ComponentLink1URL: http://www.szlcsc.com/product/details_19261.html; Package: SMD-5032_2P; Supplier: LC; SuppliersPartNumber: C18560